# Altium schematic sheet IO.SchDoc
size A; Engineer: Will Snyder; Revision: 1.0; SheetNumber: 2; SheetTotal: 5; DocumentTitle: I/O
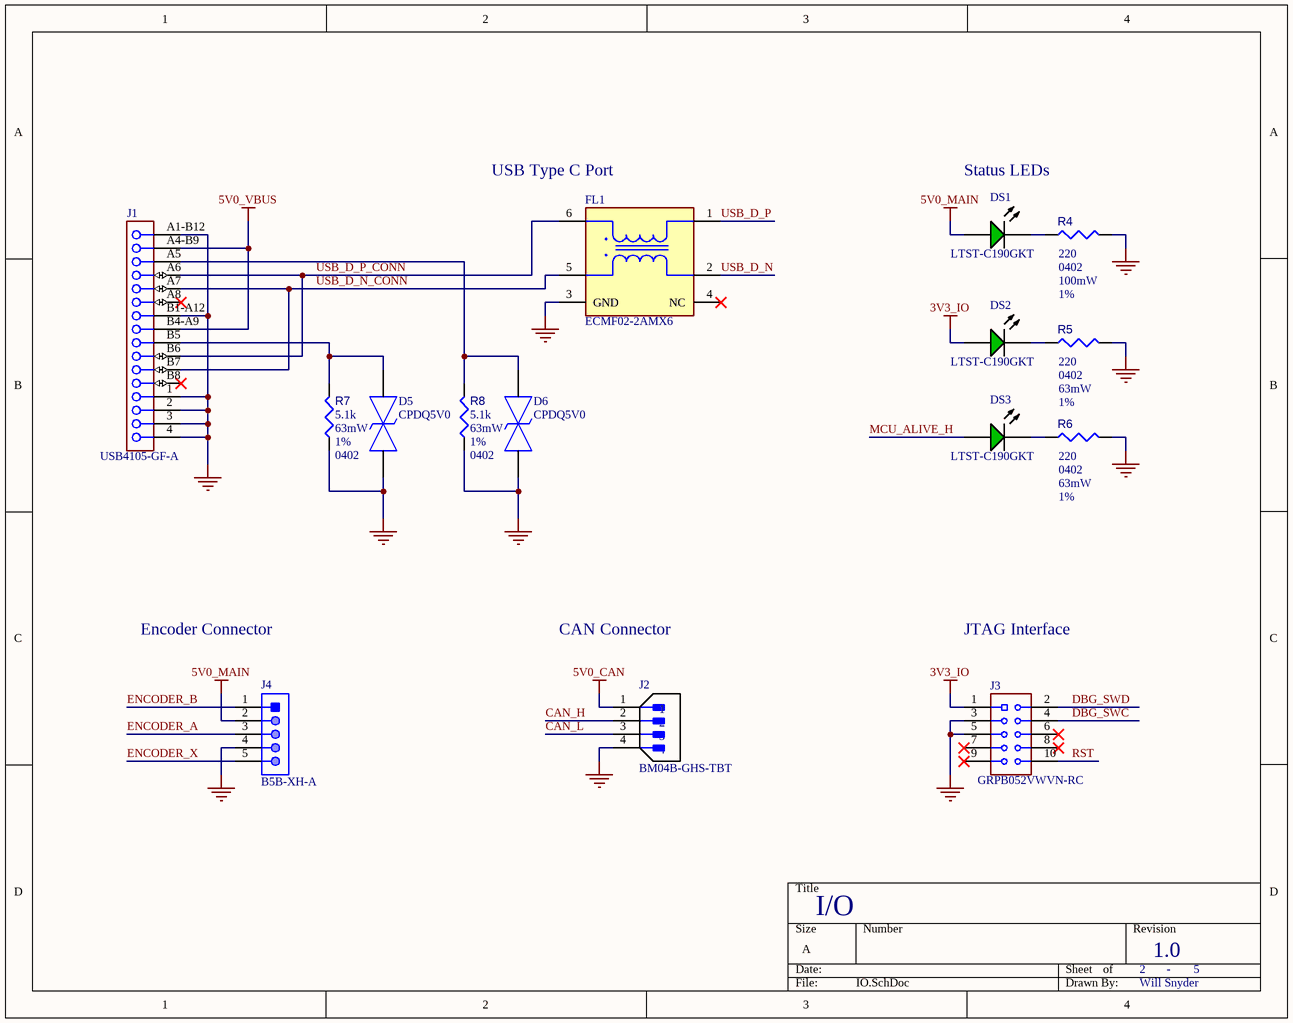
[diagram p0: IO.SchDoc]

## Parts
D5  CPDQ5V0  [MBTB-D-SOD-923F-IMP-0402]
D6  CPDQ5V0  [MBTB-D-SOD-923F-IMP-0402]
DS1  LTST-C190GKT  [LTST-C190GKT_V]
DS2  LTST-C190GKT  [LTST-C190GKT_V]
DS3  LTST-C190GKT  [LTST-C190GKT_V]
FL1  ECMF02-2AMX6  [FP-QFN-6L-IPC_A]
J1  USB4105-GF-A  [FP-USB4105-GF-A-MFG]
J2  BM04B-GHS-TBT  [FP-BM04B-GHS-TBT_LF_SN-MFG]
J3  GRPB052VWVN-RC  [SULLINS_GRPB052VWVN-RC]
J4  B5B-XH-A  [JST_B5B-XH-A]
R4  value 220  Case/Package: 0402  Tolerance: 1%  Power: 100mW  [RESC1005X40X25NL05T05]  (hidden comment: ERJ-2RKF1430X)
R5  value 220  Tolerance: 1%  Power: 63mW  Case/Package: 0402  [RESC1005X40X25NL05T05]  (hidden comment: CRCW040259R0FKED)
R6  value 220  Tolerance: 1%  Power: 63mW  Case/Package: 0402  [RESC1005X40X25NL05T05]  (hidden comment: CRCW040259R0FKED)
R7  value 5.1k  Power: 63mW  Tolerance: 1%  Case/Package: 0402  [RESC1005X40X25NL05T05]  (hidden comment: MCS04020C5101FE000)
R8  value 5.1k  Power: 63mW  Tolerance: 1%  Case/Package: 0402  [RESC1005X40X25NL05T05]  (hidden comment: MCS04020C5101FE000)

## Nets
3V3_IO: DS2.1(A) J3.1
5V0_CAN: J2.1
5V0_MAIN: DS1.1(A) J4.2
5V0_VBUS: J1.A4-B9(VBUS) J1.B4-A9(VBUS)
GND: D5.2(A) D6.2(A) FL1.3(GND) J1.1(MNT_1) J1.2(MNT_2) J1.3(MNT_3) J1.4(MNT_4) J1.A1-B12(GND) J1.B1-A12(GND) J2.4 J3.3 J3.5 J4.4 R4.2 R5.2 R6.2 R7.2 R8.2
CAN_H: J2.2
CAN_L: J2.3
DBG_SWC: J3.4
DBG_SWD: J3.2
ENCODER_A: J4.3
ENCODER_B: J4.1
ENCODER_X: J4.5
MCU_ALIVE_H: DS3.1(A)
RST: J3.10
USB_D_N: FL1.2(D-)
USB_D_N_CONN: FL1.5(D-) J1.A7(Dn1) J1.B7(Dn2)
USB_D_P: FL1.1(D+)
USB_D_P_CONN: FL1.6(D+) J1.A6(Dp1) J1.B6(Dp2)
NetD5_1: D5.1(K) J1.B5(CC2) R7.1
NetD6_1: D6.1(K) J1.A5(CC1) R8.1
NetDS1_2: DS1.2(K) R4.1
NetDS2_2: DS2.2(K) R5.1
NetDS3_2: DS3.2(K) R6.1

Not connected (* = marked no-connect by the designer): FL1 4(NC)*; J1 A8(SBU1)* B8(SBU2)*; J3 6* 7* 8* 9*

## Notes on the sheet
- USB Type C Port
- Status LEDs
- Encoder Connector
- CAN Connector
- JTAG Interface
- -

## Library data of the parts
D5 D6 = CMP-004-00042-2: 18.6V Clamp 9.4A (8/20Âµs) Ipp Tvs Diode Surface Mount 0402/SOD-923F; MF: Comchip Technology; Design Item ID: CPDQ5V0-HF; SnapEDA_Link: https://www.snapeda.com/parts/CPDQ5V0-HF/Comchip%20Technology/view-part/809934/?ref=snap; Component Type: Standard; Purchase-URL: https://pricing.snapeda.com/search/part/CPDQ5V0-HF/?ref=eda; Pins: 2; Availability: Good; Source: CPDQ5V0-HF.SchLib; Case/Package: 0402 Comchip; Price: None; MP: CPDQ5V0-HF; Check_prices: https://www.snapeda.com/parts/CPDQ5V0-HF/Comchip%20Technology/view-part/809934/?ref=eda; Value: *
DS1-DS3 = CMP-007-00022-2: LED Uni-Color Green, 100 mW, 30 mA, -55 to 85 degC, 2-Pin SMD, RoHS, Tape and Reel; Manufacturer: Lite-On; Power: 100mW; Forward Voltage: 2.1V; Viewing Angle: 130degrees; Forward Current: 20mA; Luminous Intensity: 6mcd; Lens Style: Clear; Manufacturer URL: http://www.us.liteon.com/; RoHS Compliant: True; Colour: Green; Package Description: 2-Pin Surface Mount Device, Body 1.6 x 0.8 mm; Datasheet URL: http://datasheet.octopart.com/LTST-C190GKT-Lite-On-datasheet-158530.pdf; Datasheet Version: Dec-06; Mounting Technology: SM; Case/Package: 0603; Package Reference: C190GKT; Packaging: TapeandReel; Min Operating Temperature: -55°C; Nominal Vf: 2.1V; Package Quantity: 3000; Illumination Colour: Green; Max Operating Temperature: 85°C; Pins: 2
FL1 = CMP-00030-00005-1: Data Line Filter, 2 Function(s), 6 Pin(s), Plastic; Mounting Technology: Surface Mount; RoHS Compliant: Yes; Pins: 6; Min Operating Temperature: -40°C; Max Operating Temperature: 85°C
J1 = CMP-002-00095-3: Conn USB 2.0 Type C RCP 24 POS 0.3mm/0.5mm Solder RA SMD 24 Terminal 1 Port T/R
J2 = CMP-002-00096-2: Conn Shrouded Header HDR 4 POS 1.25mm Solder ST Top Entry SMD T/R
J3 = CMP-002-00094-2: Connector Header Through Hole 10 position 0.050 (1.27mm); MF: Sullins; Price: None; Case/Package: None; SnapEDA_Link: https://www.snapeda.com/parts/GRPB052VWVN-RC/Sullins+Connector+Solutions/view-part/?ref=snap; MP: GRPB052VWVN-RC; Design Item ID: GRPB052VWVN-RC; Pins: 10; Value: *; Purchase-URL: https://pricing.snapeda.com/search/part/GRPB052VWVN-RC/?ref=eda; Source: GRPB052VWVN-RC.SchLib; Check_prices: https://www.snapeda.com/parts/GRPB052VWVN-RC/Sullins+Connector+Solutions/view-part/?ref=eda; Component Type: Standard; Availability: In Stock
J4 = CMP-002-00099-1: Connector Header, XH Series, 5 Position, 2.50mm, Through Hole, Press-Fit, Solder, Natural
R4 = CMP-009-00208-1: Fixed Resistor, Metal Glaze/thick Film, 0.1W, 143ohm, 50V, 1% +/-Tol, 100ppm/Cel, Surface Mount, 0402; Mounting Technology: Surface Mount; RoHS Compliant: Yes; Min Operating Temperature: -55°C; Pins: 2; Max Operating Temperature: 155°C
R5 R6 = CMP-009-00207-1: Fixed Resistor, Metal Glaze/thick Film, 0.063W, 59ohm, 50V, 1% +/-Tol, 100ppm/Cel, Surface Mount, 0402; Mounting Technology: Surface Mount; Max Operating Temperature: 155°C; RoHS Compliant: Yes; Min Operating Temperature: -55°C; Pins: 2
R7 R8 = CMP-009-00205-1: Fixed Resistor, Thin Film, 0.063W, 5100ohm, 50V, 1% +/-Tol, 50ppm/Cel, Surface Mount, 0402; Min Operating Temperature: -55°C; Pins: 2; Max Operating Temperature: 125°C; Mounting Technology: Surface Mount; RoHS Compliant: Yes